# Altium schematic sheet Boost.SchDoc
size A4
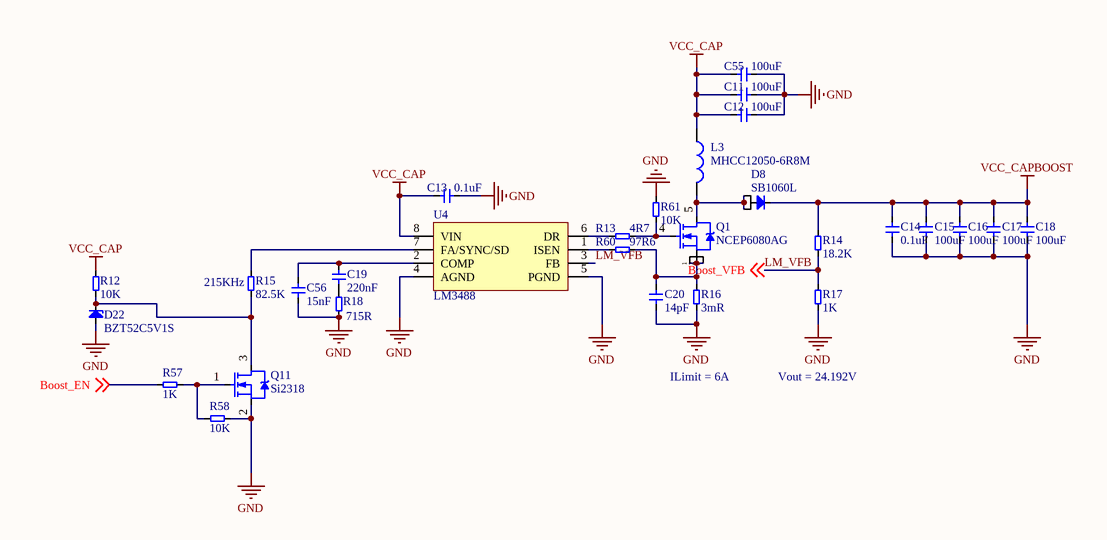
[diagram p0: Boost.SchDoc]

## Parts
C11  100uF  [CAP-1206-L]
C12  100uF  [CAP-1206-L]
C13  0.1uF  [CAP-0603-L]
C14  0.1uF  [CAP-0603-L]
C15  100uF  [CAP-1206-L]
C16  100uF  [CAP-1206-L]
C17  100uF  [CAP-1206-L]
C18  100uF  [CAP-1206-L]
C19  220nF  [CAP-0603-L]
C20  14pF  [CAP-0603-L]
C55  100uF  [CAP-1206-L]
C56  15nF  [CAP-0603-L]
D8  SB1060L  [PowerDi-5]
D22  BZT52C5V1S  [SOD_323]
L3  MHCC12050-6R8M  [L-12560]
Q1  NCEP6080AG  [DFN5x6]
Q11  Si2318  [SOT-23-3]
R12  10K  [R-0603-L]
R13  4R7  [R-0603-L]
R14  18.2K  [R-0603-L]
R15  82.5K  [R-0603-L]
R16  3mR  [R-2512-SMALL]
R17  1K  [R-0603-L]
R18  715R  [R-0603-L]
R57  1K  [R-0603-L]
R58  10K  [R-0603-L]
R60  97R6  [R-0603-L]
R61  10K  [R-0603-L]
U4  LM3488  [MSOP_E120_P0.5_10]

## Nets
GND: C11.1 C12.1 C13.1 C14.1 C15.1 C16.1 C17.1 C18.1 C20.1 C55.1 C56.1 D22.1 Q11.2(S) R16.1 R17.1 R18.1 R58.1 R61.1 U4.4(AGND) U4.5(PGND)
VCC_CAP: C11.2 C12.2 C13.2 C55.2 L3.1 R12.1 U4.8(VIN)
VCC_CAPBOOST: C14.2 C15.2 C16.2 C17.2 C18.2 D8.3 R14.2
Boost_EN: R57.2 ; off-sheet Boost_EN
LM_VFB: R14.1 R17.2 U4.3(FB) ; off-sheet Boost_VFB  [also labelled Boost_VFB]
NetC19_1: C19.1 R18.2
NetC19_2: C19.2 C56.2 U4.2(COMP)
NetC20_2: C20.2 Q1.1(S) Q1.2(S) Q1.3(S) R16.2 R60.1
NetD8_1: D8.1 D8.2 L3.2 Q1.5(D)
NetD22_2: D22.2 Q11.3(D) R12.2 R15.1
NetQ1_4: Q1.4(G) R13.1 R61.2
NetQ11_1: Q11.1(G) R57.1 R58.2
NetR13_2: R13.2 U4.6(DR)
NetR15_2: R15.2 U4.7(FA/SYNC/SD)
NetR60_2: R60.2 U4.1(ISEN)

## Notes on the sheet
- (near R15) 215KHz
- ILimit = 6A
- Vout = 24.192V

## Library data of the parts
C11-C20 C55 C56 = CAP
D8 = Diode_1
D22 = Diode_ZD
L3 = Inductor: 电感
Q1 = MOS-N_1
Q11 = MOS-N
R12-R18 R57 R58 R60 R61 = Res
U4 = LM3488: Automotive High-Efficiency Controller for Boost, SEPIC and Fly-Back DC-DCConverters